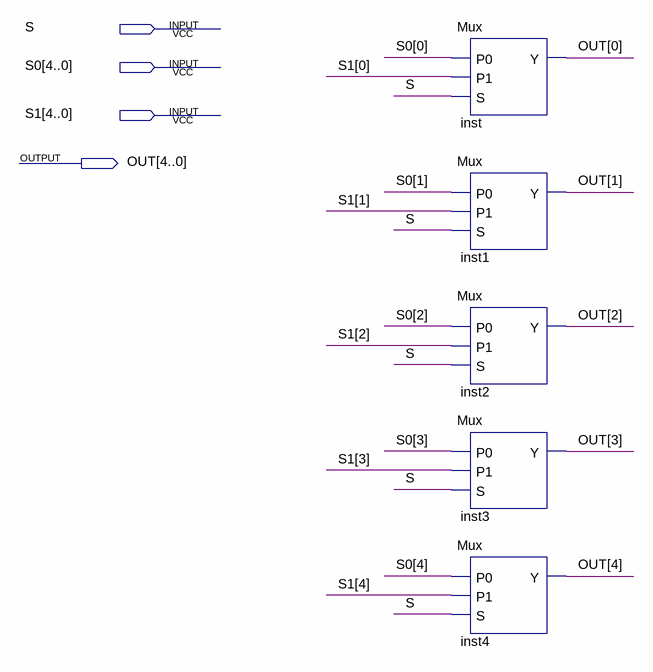
[diagram p0: schematic sheet]
// Quartus schematic Mux5.bdf as structural Verilog: 5 symbols, 4 pins
module Mux5 (
  input  S,
  input  [4:0] S0,
  input  [4:0] S1,
  output [4:0] OUT
);

  Mux inst (.P0(S0[0]), .P1(S1[0]), .S(S), .Y(OUT[0]));
  Mux inst1 (.P0(S0[1]), .P1(S1[1]), .S(S), .Y(OUT[1]));
  Mux inst2 (.P0(S0[2]), .P1(S1[2]), .S(S), .Y(OUT[2]));
  Mux inst3 (.P0(S0[3]), .P1(S1[3]), .S(S), .Y(OUT[3]));
  Mux inst4 (.P0(S0[4]), .P1(S1[4]), .S(S), .Y(OUT[4]));
endmodule
